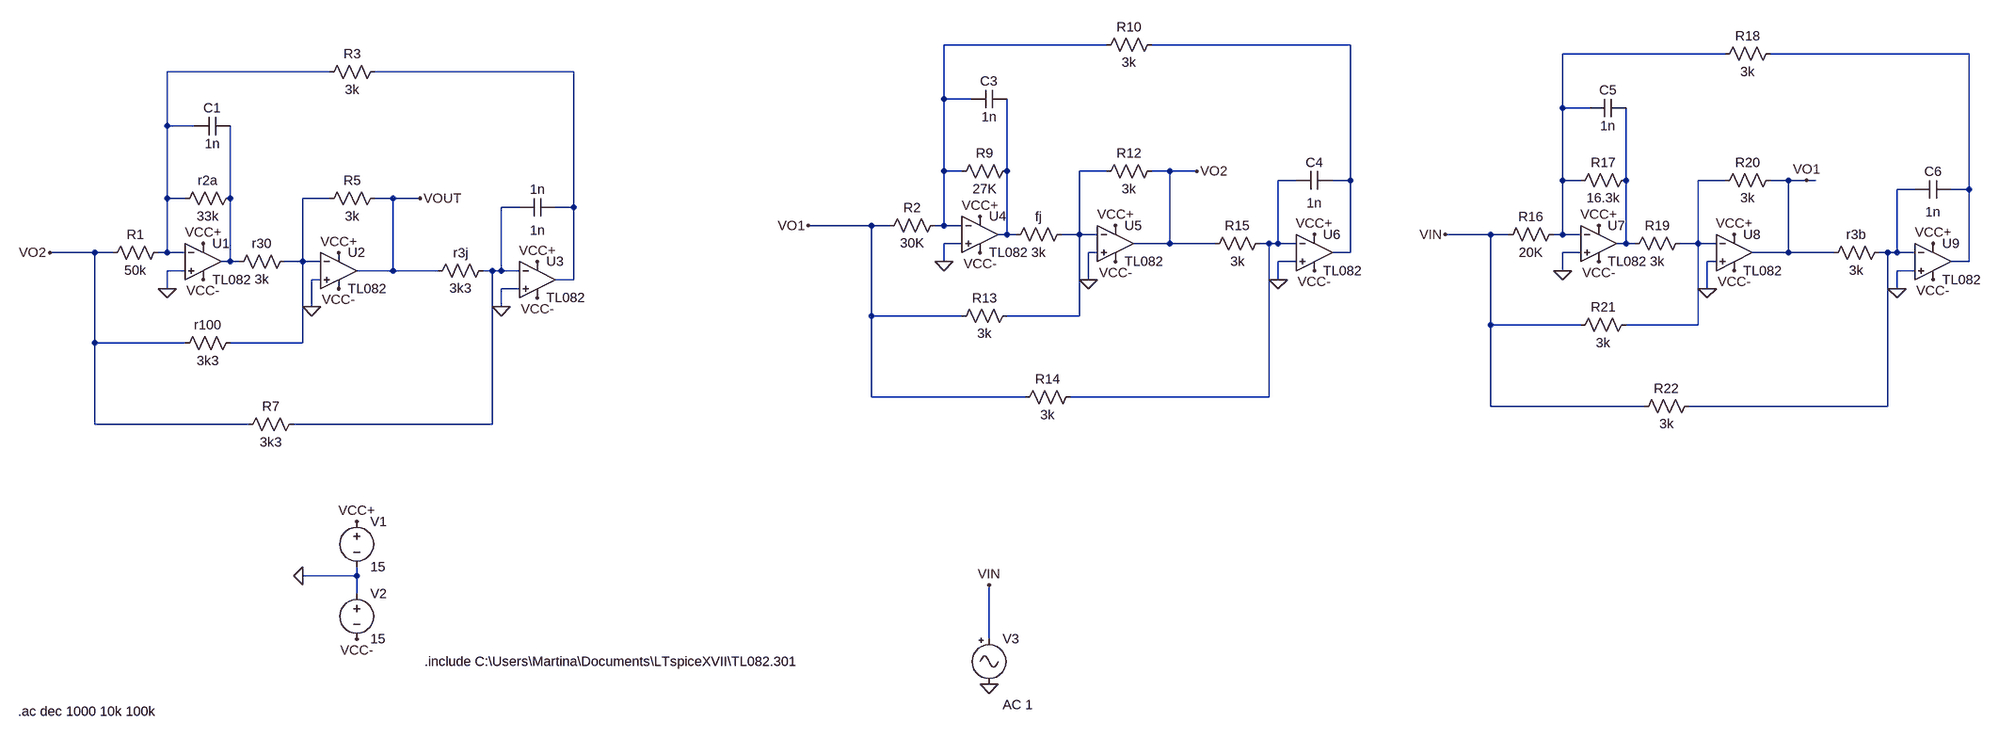
[diagram p0: schematic UNIVERSAL.asc]
UNIVERSAL.asc, the LTspice schematic file:
Version 4
SHEET 1 3776 960
WIRE 1664 -288 1376 -288
WIRE 2096 -288 1744 -288
WIRE 2800 -272 2512 -272
WIRE 3232 -272 2880 -272
WIRE 288 -240 0 -240
WIRE 720 -240 368 -240
WIRE 1376 -192 1376 -288
WIRE 1424 -192 1376 -192
WIRE 2512 -176 2512 -272
WIRE 2560 -176 2512 -176
WIRE 0 -144 0 -240
WIRE 48 -144 0 -144
WIRE 1376 -64 1376 -192
WIRE 1408 -64 1376 -64
WIRE 1488 -64 1488 -192
WIRE 1664 -64 1616 -64
WIRE 1776 -64 1744 -64
WIRE 1824 -64 1776 -64
WIRE 2000 -48 1968 -48
WIRE 2096 -48 2096 -288
WIRE 2096 -48 2064 -48
WIRE 2512 -48 2512 -176
WIRE 2544 -48 2512 -48
WIRE 2624 -48 2624 -176
WIRE 2800 -48 2752 -48
WIRE 2912 -48 2880 -48
WIRE 2944 -48 2912 -48
WIRE 2960 -48 2944 -48
WIRE 3136 -32 3104 -32
WIRE 3232 -32 3232 -272
WIRE 3232 -32 3200 -32
WIRE 0 -16 0 -144
WIRE 32 -16 0 -16
WIRE 112 -16 112 -144
WIRE 288 -16 240 -16
WIRE 400 -16 368 -16
WIRE 448 -16 400 -16
WIRE 624 0 592 0
WIRE 720 0 720 -240
WIRE 720 0 688 0
WIRE 1248 32 1136 32
WIRE 1280 32 1248 32
WIRE 1376 32 1376 -64
WIRE 1376 32 1360 32
WIRE 1408 32 1376 32
WIRE 1488 48 1488 -64
WIRE 1488 48 1472 48
WIRE 1504 48 1488 48
WIRE 1616 48 1616 -64
WIRE 1616 48 1584 48
WIRE 1648 48 1616 48
WIRE 2384 48 2304 48
WIRE 2416 48 2384 48
WIRE 2512 48 2512 -48
WIRE 2512 48 2496 48
WIRE 2544 48 2512 48
WIRE 1408 64 1376 64
WIRE 1776 64 1776 -64
WIRE 1776 64 1712 64
WIRE 1856 64 1776 64
WIRE 1952 64 1936 64
WIRE 1968 64 1968 -48
WIRE 1968 64 1952 64
WIRE 2000 64 1968 64
WIRE 2624 64 2624 -48
WIRE 2624 64 2608 64
WIRE 2640 64 2624 64
WIRE 2752 64 2752 -48
WIRE 2752 64 2720 64
WIRE 2784 64 2752 64
WIRE -128 80 -208 80
WIRE -96 80 -128 80
WIRE 0 80 0 -16
WIRE 0 80 -16 80
WIRE 32 80 0 80
WIRE 1648 80 1632 80
WIRE 2096 80 2096 -48
WIRE 2096 80 2064 80
WIRE 2544 80 2512 80
WIRE 2912 80 2912 -48
WIRE 2912 80 2848 80
WIRE 2992 80 2912 80
WIRE 3088 80 3072 80
WIRE 3104 80 3104 -32
WIRE 3104 80 3088 80
WIRE 3136 80 3104 80
WIRE 112 96 112 -16
WIRE 112 96 96 96
WIRE 128 96 112 96
WIRE 240 96 240 -16
WIRE 240 96 208 96
WIRE 272 96 240 96
WIRE 1376 96 1376 64
WIRE 2000 96 1968 96
WIRE 2784 96 2768 96
WIRE 3232 96 3232 -32
WIRE 3232 96 3200 96
WIRE 32 112 0 112
WIRE 400 112 400 -16
WIRE 400 112 336 112
WIRE 480 112 400 112
WIRE 576 112 560 112
WIRE 592 112 592 0
WIRE 592 112 576 112
WIRE 624 112 592 112
WIRE 2512 112 2512 80
WIRE 3136 112 3104 112
WIRE 272 128 256 128
WIRE 720 128 720 0
WIRE 720 128 688 128
WIRE 1632 128 1632 80
WIRE 1968 128 1968 96
WIRE 0 144 0 112
WIRE 624 144 592 144
WIRE 2768 144 2768 96
WIRE 3104 144 3104 112
WIRE 256 176 256 128
WIRE 592 176 592 144
WIRE 1248 192 1248 32
WIRE 1408 192 1248 192
WIRE 1616 192 1616 48
WIRE 1616 192 1488 192
WIRE 2384 208 2384 48
WIRE 2544 208 2384 208
WIRE 2752 208 2752 64
WIRE 2752 208 2624 208
WIRE -128 240 -128 80
WIRE 32 240 -128 240
WIRE 240 240 240 96
WIRE 240 240 112 240
WIRE 1248 336 1248 192
WIRE 1520 336 1248 336
WIRE 1952 336 1952 64
WIRE 1952 336 1600 336
WIRE 2384 352 2384 208
WIRE 2656 352 2384 352
WIRE 3088 352 3088 80
WIRE 3088 352 2736 352
WIRE -128 384 -128 240
WIRE 144 384 -128 384
WIRE 576 384 576 112
WIRE 576 384 224 384
WIRE 336 704 336 688
WIRE 336 704 240 704
WIRE 336 736 336 704
WIRE 1456 816 1456 720
FLAG 0 144 0
FLAG 256 176 0
FLAG 592 176 0
FLAG 64 64 VCC+
FLAG 304 80 VCC+
FLAG 656 96 VCC+
FLAG 336 608 VCC+
FLAG 64 128 VCC-
FLAG 304 144 VCC-
FLAG 656 160 VCC-
FLAG 336 816 VCC-
FLAG 2304 48 VIN
FLAG 240 704 0
FLAG 1376 96 0
FLAG 1632 128 0
FLAG 1968 128 0
FLAG 1440 16 VCC+
FLAG 1680 32 VCC+
FLAG 2032 48 VCC+
FLAG 1440 80 VCC-
FLAG 1680 96 VCC-
FLAG 2032 112 VCC-
FLAG 2512 112 0
FLAG 2768 144 0
FLAG 3104 144 0
FLAG 2576 32 VCC+
FLAG 2816 48 VCC+
FLAG 3168 64 VCC+
FLAG 2576 96 VCC-
FLAG 2816 112 VCC-
FLAG 3168 128 VCC-
FLAG 1136 32 VO1
FLAG 1824 -64 VO2
FLAG -208 80 VO2
FLAG 448 -16 VOUT
FLAG 1456 896 0
FLAG 1456 720 VIN
FLAG 2944 -48 VO1
SYMBOL res 0 64 R90
WINDOW 0 0 56 VBottom 2
WINDOW 3 32 56 VTop 2
SYMATTR InstName R1
SYMATTR Value 50k
SYMBOL res 128 -32 R90
WINDOW 0 0 56 VBottom 2
WINDOW 3 32 56 VTop 2
SYMATTR InstName r2a
SYMATTR Value 33k
SYMBOL res 384 -256 R90
WINDOW 0 0 56 VBottom 2
WINDOW 3 32 56 VTop 2
SYMATTR InstName R3
SYMATTR Value 3k
SYMBOL res 224 80 R90
WINDOW 0 0 56 VBottom 2
WINDOW 3 32 56 VTop 2
SYMATTR InstName r30
SYMATTR Value 3k
SYMBOL res 384 -32 R90
WINDOW 0 0 56 VBottom 2
WINDOW 3 32 56 VTop 2
SYMATTR InstName R5
SYMATTR Value 3k
SYMBOL res 128 224 R90
WINDOW 0 0 56 VBottom 2
WINDOW 3 32 56 VTop 2
SYMATTR InstName r100
SYMATTR Value 3k3
SYMBOL res 240 368 R90
WINDOW 0 0 56 VBottom 2
WINDOW 3 32 56 VTop 2
SYMATTR InstName R7
SYMATTR Value 3k3
SYMBOL res 576 96 R90
WINDOW 0 0 56 VBottom 2
WINDOW 3 32 56 VTop 2
SYMATTR InstName r3j
SYMATTR Value 3k3
SYMBOL cap 112 -160 R90
WINDOW 0 0 32 VBottom 2
WINDOW 3 32 32 VTop 2
SYMATTR InstName C1
SYMATTR Value 1n
SYMBOL cap 688 -16 R90
WINDOW 0 0 32 VBottom 2
WINDOW 3 41 32 VTop 2
SYMATTR InstName 1n
SYMATTR Value 1n
SYMBOL voltage 336 592 R0
WINDOW 123 0 0 Left 2
WINDOW 39 0 0 Left 2
SYMATTR InstName V1
SYMATTR Value 15
SYMBOL voltage 336 720 R0
WINDOW 123 0 0 Left 2
WINDOW 39 0 0 Left 2
SYMATTR InstName V2
SYMATTR Value 15
SYMBOL res 1376 16 R90
WINDOW 0 0 56 VBottom 2
WINDOW 3 32 56 VTop 2
SYMATTR InstName R2
SYMATTR Value 30K
SYMBOL res 1504 -80 R90
WINDOW 0 0 56 VBottom 2
WINDOW 3 32 56 VTop 2
SYMATTR InstName R9
SYMATTR Value 27K
SYMBOL res 1760 -304 R90
WINDOW 0 0 56 VBottom 2
WINDOW 3 32 56 VTop 2
SYMATTR InstName R10
SYMATTR Value 3k
SYMBOL res 1600 32 R90
WINDOW 0 0 56 VBottom 2
WINDOW 3 32 56 VTop 2
SYMATTR InstName fj
SYMATTR Value 3k
SYMBOL res 1760 -80 R90
WINDOW 0 0 56 VBottom 2
WINDOW 3 32 56 VTop 2
SYMATTR InstName R12
SYMATTR Value 3k
SYMBOL res 1504 176 R90
WINDOW 0 0 56 VBottom 2
WINDOW 3 32 56 VTop 2
SYMATTR InstName R13
SYMATTR Value 3k
SYMBOL res 1616 320 R90
WINDOW 0 0 56 VBottom 2
WINDOW 3 32 56 VTop 2
SYMATTR InstName R14
SYMATTR Value 3k
SYMBOL res 1952 48 R90
WINDOW 0 0 56 VBottom 2
WINDOW 3 32 56 VTop 2
SYMATTR InstName R15
SYMATTR Value 3k
SYMBOL cap 1488 -208 R90
WINDOW 0 0 32 VBottom 2
WINDOW 3 32 32 VTop 2
SYMATTR InstName C3
SYMATTR Value 1n
SYMBOL cap 2064 -64 R90
WINDOW 0 0 32 VBottom 2
WINDOW 3 41 32 VTop 2
SYMATTR InstName C4
SYMATTR Value 1n
SYMBOL res 2512 32 R90
WINDOW 0 0 56 VBottom 2
WINDOW 3 32 56 VTop 2
SYMATTR InstName R16
SYMATTR Value 20K
SYMBOL res 2640 -64 R90
WINDOW 0 0 56 VBottom 2
WINDOW 3 32 56 VTop 2
SYMATTR InstName R17
SYMATTR Value 16.3k
SYMBOL res 2896 -288 R90
WINDOW 0 0 56 VBottom 2
WINDOW 3 32 56 VTop 2
SYMATTR InstName R18
SYMATTR Value 3k
SYMBOL res 2736 48 R90
WINDOW 0 0 56 VBottom 2
WINDOW 3 32 56 VTop 2
SYMATTR InstName R19
SYMATTR Value 3k
SYMBOL res 2896 -64 R90
WINDOW 0 0 56 VBottom 2
WINDOW 3 32 56 VTop 2
SYMATTR InstName R20
SYMATTR Value 3k
SYMBOL res 2640 192 R90
WINDOW 0 0 56 VBottom 2
WINDOW 3 32 56 VTop 2
SYMATTR InstName R21
SYMATTR Value 3k
SYMBOL res 2752 336 R90
WINDOW 0 0 56 VBottom 2
WINDOW 3 32 56 VTop 2
SYMATTR InstName R22
SYMATTR Value 3k
SYMBOL res 3088 64 R90
WINDOW 0 0 56 VBottom 2
WINDOW 3 32 56 VTop 2
SYMATTR InstName r3b
SYMATTR Value 3k
SYMBOL cap 2624 -192 R90
WINDOW 0 0 32 VBottom 2
WINDOW 3 32 32 VTop 2
SYMATTR InstName C5
SYMATTR Value 1n
SYMBOL cap 3200 -48 R90
WINDOW 0 0 32 VBottom 2
WINDOW 3 41 32 VTop 2
SYMATTR InstName C6
SYMATTR Value 1n
SYMBOL Misc\\signal 1456 800 R0
WINDOW 123 24 132 Left 2
WINDOW 39 0 0 Left 2
SYMATTR Value2 AC 1
SYMATTR InstName V3
SYMATTR Value ""
SYMBOL Opamps\\opamp2 64 32 R0
SYMATTR InstName U1
SYMATTR Value TL082
SYMBOL Opamps\\opamp2 304 48 R0
SYMATTR InstName U2
SYMATTR Value TL082
SYMBOL Opamps\\opamp2 2032 16 R0
SYMATTR InstName U6
SYMATTR Value TL082
SYMBOL Opamps\\opamp2 2576 0 R0
SYMATTR InstName U7
SYMATTR Value TL082
SYMBOL Opamps\\opamp2 2816 16 R0
SYMATTR InstName U8
SYMATTR Value TL082
SYMBOL Opamps\\opamp2 656 64 R0
SYMATTR InstName U3
SYMATTR Value TL082
SYMBOL Opamps\\opamp2 1440 -16 R0
SYMATTR InstName U4
SYMATTR Value TL082
SYMBOL Opamps\\opamp2 1680 0 R0
SYMATTR InstName U5
SYMATTR Value TL082
SYMBOL Opamps\\opamp2 3168 32 R0
SYMATTR InstName U9
SYMATTR Value TL082
TEXT 456 856 Left 2 !.include C:\\Users\\Martina\\Documents\\LTspiceXVII\\TL082.301
TEXT -264 944 Left 2 !.ac dec 1000 10k 100k

The netlist it stands for:
* UNIVERSAL.asc
R1 N005 VO2 50k
r2a N013 N005 33k
R3 N006 N005 3k
r30 N014 N013 3k
R5 VOUT N014 3k
r100 N014 VO2 3k3
R7 N015 VO2 3k3
r3j N015 VOUT 3k3
C1 N013 N005 1n
C§1n N006 N015 1n
V1 VCC+ 0 15
V2 0 VCC- 15
R2 N001 VO1 30K
R9 N007 N001 27K
R10 N002 N001 3k
R§fj N008 N007 3k
R12 VO2 N008 3k
R13 N008 VO1 3k
R14 N009 VO1 3k
R15 N009 VO2 3k
C3 N007 N001 1n
C4 N002 N009 1n
R16 N003 VIN 20K
R17 N010 N003 16.3k
R18 N004 N003 3k
R19 N011 N010 3k
R20 VO1 N011 3k
R21 N011 VIN 3k
R22 N012 VIN 3k
r3b N012 VO1 3k
C5 N010 N003 1n
C6 N004 N012 1n
V3 VIN 0 AC 1
XU1 0 N005 VCC+ VCC- N013 TL082  ; pins In+ In- V+ V- OUT
XU2 0 N014 VCC+ VCC- VOUT TL082  ; pins In+ In- V+ V- OUT
XU6 0 N009 VCC+ VCC- N002 TL082  ; pins In+ In- V+ V- OUT
XU7 0 N003 VCC+ VCC- N010 TL082  ; pins In+ In- V+ V- OUT
XU8 0 N011 VCC+ VCC- VO1 TL082  ; pins In+ In- V+ V- OUT
XU3 0 N015 VCC+ VCC- N006 TL082  ; pins In+ In- V+ V- OUT
XU4 0 N001 VCC+ VCC- N007 TL082  ; pins In+ In- V+ V- OUT
XU5 0 N008 VCC+ VCC- VO2 TL082  ; pins In+ In- V+ V- OUT
XU9 0 N012 VCC+ VCC- N004 TL082  ; pins In+ In- V+ V- OUT
.include C:\Users\Martina\Documents\LTspiceXVII\TL082.301
.ac dec 1000 10k 100k
.backanno
.end